# Altium project H3_PCB_PROJ.PrjPCB
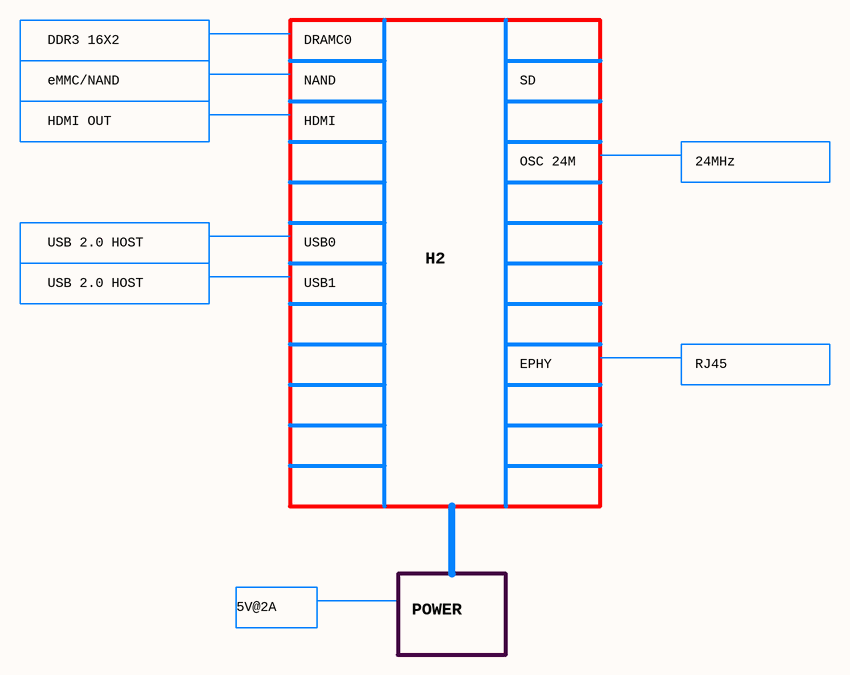
[diagram p0: 1_BLOCK.SchDoc]
6 sheets, 137 parts. Net scope: global (net labels, ports and power ports of the same name join across sheets).
Board files: H3_PCB.PcbDoc, STENCILS.PcbDoc
Sheets:
  1_BLOCK.SchDoc
  2_POWER_TREE.SchDoc
  3_DDR3.SchDoc
  4_CPU.SchDoc
  5_POWER.SchDoc
  6_eMMC.SchDoc

## Sheet 1_BLOCK.SchDoc
size A4

### Notes on the sheet
- DDR3 16X2
- DRAMC0
- eMMC/NAND
- NAND
- SD
- HDMI OUT
- HDMI
- OSC 24M
- 24MHz
- USB 2.0 HOST
- USB0
- USB1
- H2
- EPHY
- RJ45
- 5V@2A
- POWER

## Sheet 2_POWER_TREE.SchDoc
size A4

## Sheet 3_DDR3.SchDoc
size A4
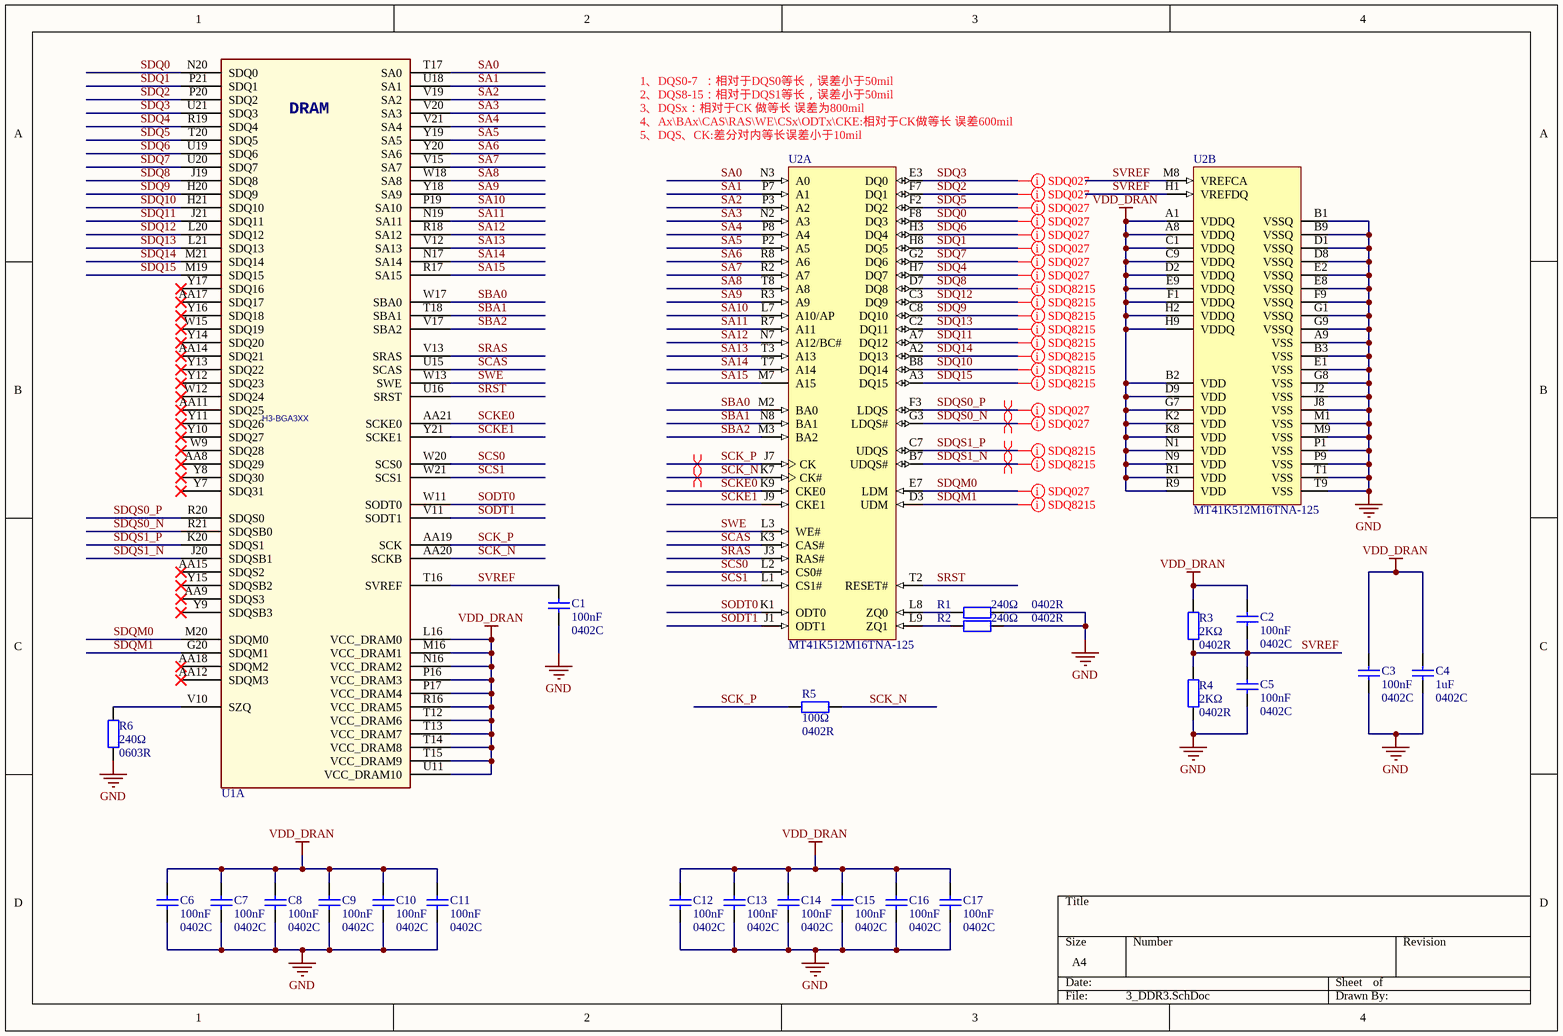
[diagram p1: 3_DDR3.SchDoc]

### Parts
C1  100nF  Package: 0402C  [0402_C]
C2  100nF  Package: 0402C  [0402_C]
C3  100nF  Package: 0402C  [0402_C]
C4  1uF  Package: 0402C  [0402_C]
C5  100nF  Package: 0402C  [0402_C]
C6  100nF  Package: 0402C  [0402_C]
C7  100nF  Package: 0402C  [0402_C]
C8  100nF  Package: 0402C  [0402_C]
C9  100nF  Package: 0402C  [0402_C]
C10  100nF  Package: 0402C  [0402_C]
C11  100nF  Package: 0402C  [0402_C]
C12  100nF  Package: 0402C  [0402_C]
C13  100nF  Package: 0402C  [0402_C]
C14  100nF  Package: 0402C  [0402_C]
C15  100nF  Package: 0402C  [0402_C]
C16  100nF  Package: 0402C  [0402_C]
C17  100nF  Package: 0402C  [0402_C]
R1  240Ω  Package: 0402R  [0402_R]
R2  240Ω  Package: 0402R  [0402_R]
R3  2KΩ  Package: 0402R  [0402_R]
R4  2KΩ  Package: 0402R  [0402_R]
R5  100Ω  Package: 0402R  [0402_R]
R6  240Ω  Package: 0603R  [0603_R]
U1  H3-BGA3XX  [BGA347P0_65B14X14]  (part A of 9)
U2  MT41K512M16TNA-125  [MICT-TNA-96]  (parts A,B of 2)

### Nets
GND: C1.1 C3.1 C4.1 C5.1 C6.1 C7.1 C8.1 C9.1 C10.1 C11.1 C12.1 C13.1 C14.1 C15.1 C16.1 C17.1 R1.1 R2.1 R4.2 R6.1 U2.A9(VSS) U2.B1(VSSQ) U2.B3(VSS) U2.B9(VSSQ) U2.D1(VSSQ) U2.D8(VSSQ) U2.E1(VSS) U2.E2(VSSQ) U2.E8(VSSQ) U2.F9(VSSQ) U2.G1(VSSQ) U2.G8(VSS) U2.G9(VSSQ) U2.J2(VSS) U2.J8(VSS) U2.M1(VSS) U2.M9(VSS) U2.P1(VSS) U2.P9(VSS) U2.T1(VSS) U2.T9(VSS)
VDD_DRAN: C2.2 C3.2 C4.2 C6.2 C7.2 C8.2 C9.2 C10.2 C11.2 C12.2 C13.2 C14.2 C15.2 C16.2 C17.2 R3.1 U1.L16(VCC_DRAM0) U1.M16(VCC_DRAM1) U1.N16(VCC_DRAM2) U1.P16(VCC_DRAM3) U1.P17(VCC_DRAM4) U1.R16(VCC_DRAM5) U1.T12(VCC_DRAM6) U1.T13(VCC_DRAM7) U1.T14(VCC_DRAM8) U1.T15(VCC_DRAM9) U1.U11(VCC_DRAM10) U2.A1(VDDQ) U2.A8(VDDQ) U2.B2(VDD) U2.C1(VDDQ) U2.C9(VDDQ) U2.D2(VDDQ) U2.D9(VDD) U2.E9(VDDQ) U2.F1(VDDQ) U2.G7(VDD) U2.H2(VDDQ) U2.H9(VDDQ) U2.K2(VDD) U2.K8(VDD) U2.N1(VDD) U2.N9(VDD) U2.R1(VDD) U2.R9(VDD)
SA0: U1.T17(SA0) U2.N3(A0)
SA1: U1.U18(SA1) U2.P7(A1)
SA2: U1.V19(SA2) U2.P3(A2)
SA3: U1.V20(SA3) U2.N2(A3)
SA4: U1.V21(SA4) U2.P8(A4)
SA5: U1.Y19(SA5) U2.P2(A5)
SA6: U1.Y20(SA6) U2.R8(A6)
SA7: U1.V15(SA7) U2.R2(A7)
SA8: U1.W18(SA8) U2.T8(A8)
SA9: U1.Y18(SA9) U2.R3(A9)
SA10: U1.P19(SA10) U2.L7(A10/AP)
SA11: U1.N19(SA11) U2.R7(A11)
SA12: U1.R18(SA12) U2.N7(A12/BC#)
SA13: U1.V12(SA13) U2.T3(A13)
SA14: U1.N17(SA14) U2.T7(A14)
SA15: U1.R17(SA15) U2.M7(A15)
SBA0: U1.W17(SBA0) U2.M2(BA0)
SBA1: U1.T18(SBA1) U2.N8(BA1)
SBA2: U1.V17(SBA2) U2.M3(BA2)
SCAS: U1.U15(SCAS) U2.K3(CAS#)
SCK_N: R5.1 U1.AA20(SCKB) U2.K7(CK#)
SCK_P: R5.2 U1.AA19(SCK) U2.J7(CK)
SCKE0: U1.AA21(SCKE0) U2.K9(CKE0)
SCKE1: U1.Y21(SCKE1) U2.J9(CKE1)
SCS0: U1.W20(SCS0) U2.L2(CS0#)
SCS1: U1.W21(SCS1) U2.L1(CS1#)
SDQ0: U1.N20(SDQ0) U2.F8(DQ3)
SDQ1: U1.P21(SDQ1) U2.H8(DQ5)
SDQ2: U1.P20(SDQ2) U2.F7(DQ1)
SDQ3: U1.U21(SDQ3) U2.E3(DQ0)
SDQ4: U1.R19(SDQ4) U2.H7(DQ7)
SDQ5: U1.T20(SDQ5) U2.F2(DQ2)
SDQ6: U1.U19(SDQ6) U2.H3(DQ4)
SDQ7: U1.U20(SDQ7) U2.G2(DQ6)
SDQ8: U1.J19(SDQ8) U2.D7(DQ8)
SDQ9: U1.H20(SDQ9) U2.C8(DQ10)
SDQ10: U1.H21(SDQ10) U2.B8(DQ14)
SDQ11: U1.J21(SDQ11) U2.A7(DQ12)
SDQ12: U1.L20(SDQ12) U2.C3(DQ9)
SDQ13: U1.L21(SDQ13) U2.C2(DQ11)
SDQ14: U1.M21(SDQ14) U2.A2(DQ13)
SDQ15: U1.M19(SDQ15) U2.A3(DQ15)
SDQM0: U1.M20(SDQM0) U2.E7(LDM)
SDQM1: U1.G20(SDQM1) U2.D3(UDM)
SDQS0_N: U1.R21(SDQSB0) U2.G3(LDQS#)
SDQS0_P: U1.R20(SDQS0) U2.F3(LDQS)
SDQS1_N: U1.J20(SDQSB1) U2.B7(UDQS#)
SDQS1_P: U1.K20(SDQS1) U2.C7(UDQS)
SODT0: U1.W11(SODT0) U2.K1(ODT0)
SODT1: U1.V11(SODT1) U2.J1(ODT1)
SRAS: U1.V13(SRAS) U2.J3(RAS#)
SRST: U1.U16(SRST) U2.T2(RESET#)
SVREF: C1.2 C2.1 C5.2 R3.2 R4.1 U1.T16(SVREF) U2.H1(VREFDQ) U2.M8(VREFCA)
SWE: U1.W13(SWE) U2.L3(WE#)
NetR1_2: R1.2 U2.L8(ZQ0)
NetR2_2: R2.2 U2.L9(ZQ1)
NetR6_2: R6.2 U1.V10(SZQ)

Not connected (* = marked no-connect by the designer): U1 AA8(SDQ29)* AA9(SDQS3)* AA11(SDQ25)* AA12(SDQM3)* AA14(SDQ21)* AA15(SDQS2)* AA17(SDQ17)* AA18(SDQM2)* W9(SDQ28)* W12(SDQ24)* W15(SDQ19)* Y7(SDQ31)* Y8(SDQ30)* Y9(SDQSB3)* Y10(SDQ27)* Y11(SDQ26)* Y12(SDQ23)* Y13(SDQ22)* Y14(SDQ20)* Y15(SDQSB2)* Y16(SDQ18)* Y17(SDQ16)*

### Layout directives
differential pair: SCK_N, SCK_P, SDQS0_N, SDQS0_P, SDQS1_N, SDQS1_P
net class Undefined: SDQ0, SDQ1, SDQ2, SDQ3, SDQ4, SDQ5, SDQ6, SDQ7, SDQ8, SDQ9, SDQ10, SDQ11, SDQ12, SDQ13, SDQ14, SDQ15, SDQM0, SDQM1, SDQS0_N, SDQS0_P, SDQS1_N, SDQS1_P

### Notes on the sheet
- (near U2) 1、DQS0-7  ：相对于DQS0等长，误差小于50mil
  2、DQS8-15：相对于DQS1等长，误差小于50mil
  3、DQSx：相对于CK 做等长 误差为800mil
  4、Ax\BAx\CAS\RAS\WE\CSx\ODTx\CKE:相对于CK做等长 误差600mil
  5、DQS、CK:差分对内等长误差小于10mil
- (in symbol H3-BGA3XX, part A) DRAM

### Library data of the parts
C1-C17 = 0402 1nF (102) 10% 50V: 贴片电容; ComponentLink1Description: 供应商链接; ComponentLink1URL: http://www.szlcsc.com/product/details_1875.html; Supplier: LC; SuppliersPartNumber: C1523
R1-R6 = 0402 1KΩ (1001) 1%: 贴片电阻; ComponentLink1Description: 供应商链接; ComponentLink1URL: http://www.szlcsc.com/product/details_12256.html; Supplier: LC; SuppliersPartNumber: C11702
U2 = MT41K512M16TNA-125: 8Gb SDRAM, 512Mb x 16, 1.25ns, 1.35V, 0 to 95 degC, 96-Ball FBGA, Pb-Free; Manufacturer: Micron; CL: CL = 11?; Clock Rate: 800 MHz?; Cycle Time: 1.25ns?; Density: 8Gb?; Op. Temp.: 0C to +95C?; Voltage: 1.35V?; DatasheetVersion: Rev. A; PackageVersion: Rev.E; PackageReference: MICT-TNA-96; PackageDescription: 96-Ball Fine-Pitch Ball Grid Array, 14 x 10 mm, Pitch 0.8 mm; Depth: 512Mb?; Package: FBGA?; Pin Count: 96-ball?; RoHS: Yes?; Width: x16?; Mounting Technology: Surface Mount; PartNumber: MT41K512M16TNA-125; ComponentLink1Description: Manufacturer URL; ComponentLink1URL: http://www.micron.com/; ComponentLink2Description: Datasheet; ComponentLink2URL: http://www.micron.com/~/media/Documents/Products/Data%20Sheet/DRAM/DDR3L_8Gb_x16_2CS_TwinDie_V80A.pdf; ComponentLink3Description: Package Specification; ComponentLink3URL: http://www.micron.com/~/media/Documents/Products/Data%20Sheet/DRAM/DDR3L-RS_8Gb_x16_2CS_TwinDie_V80A.pdf

## Sheet 4_CPU.SchDoc
size A3
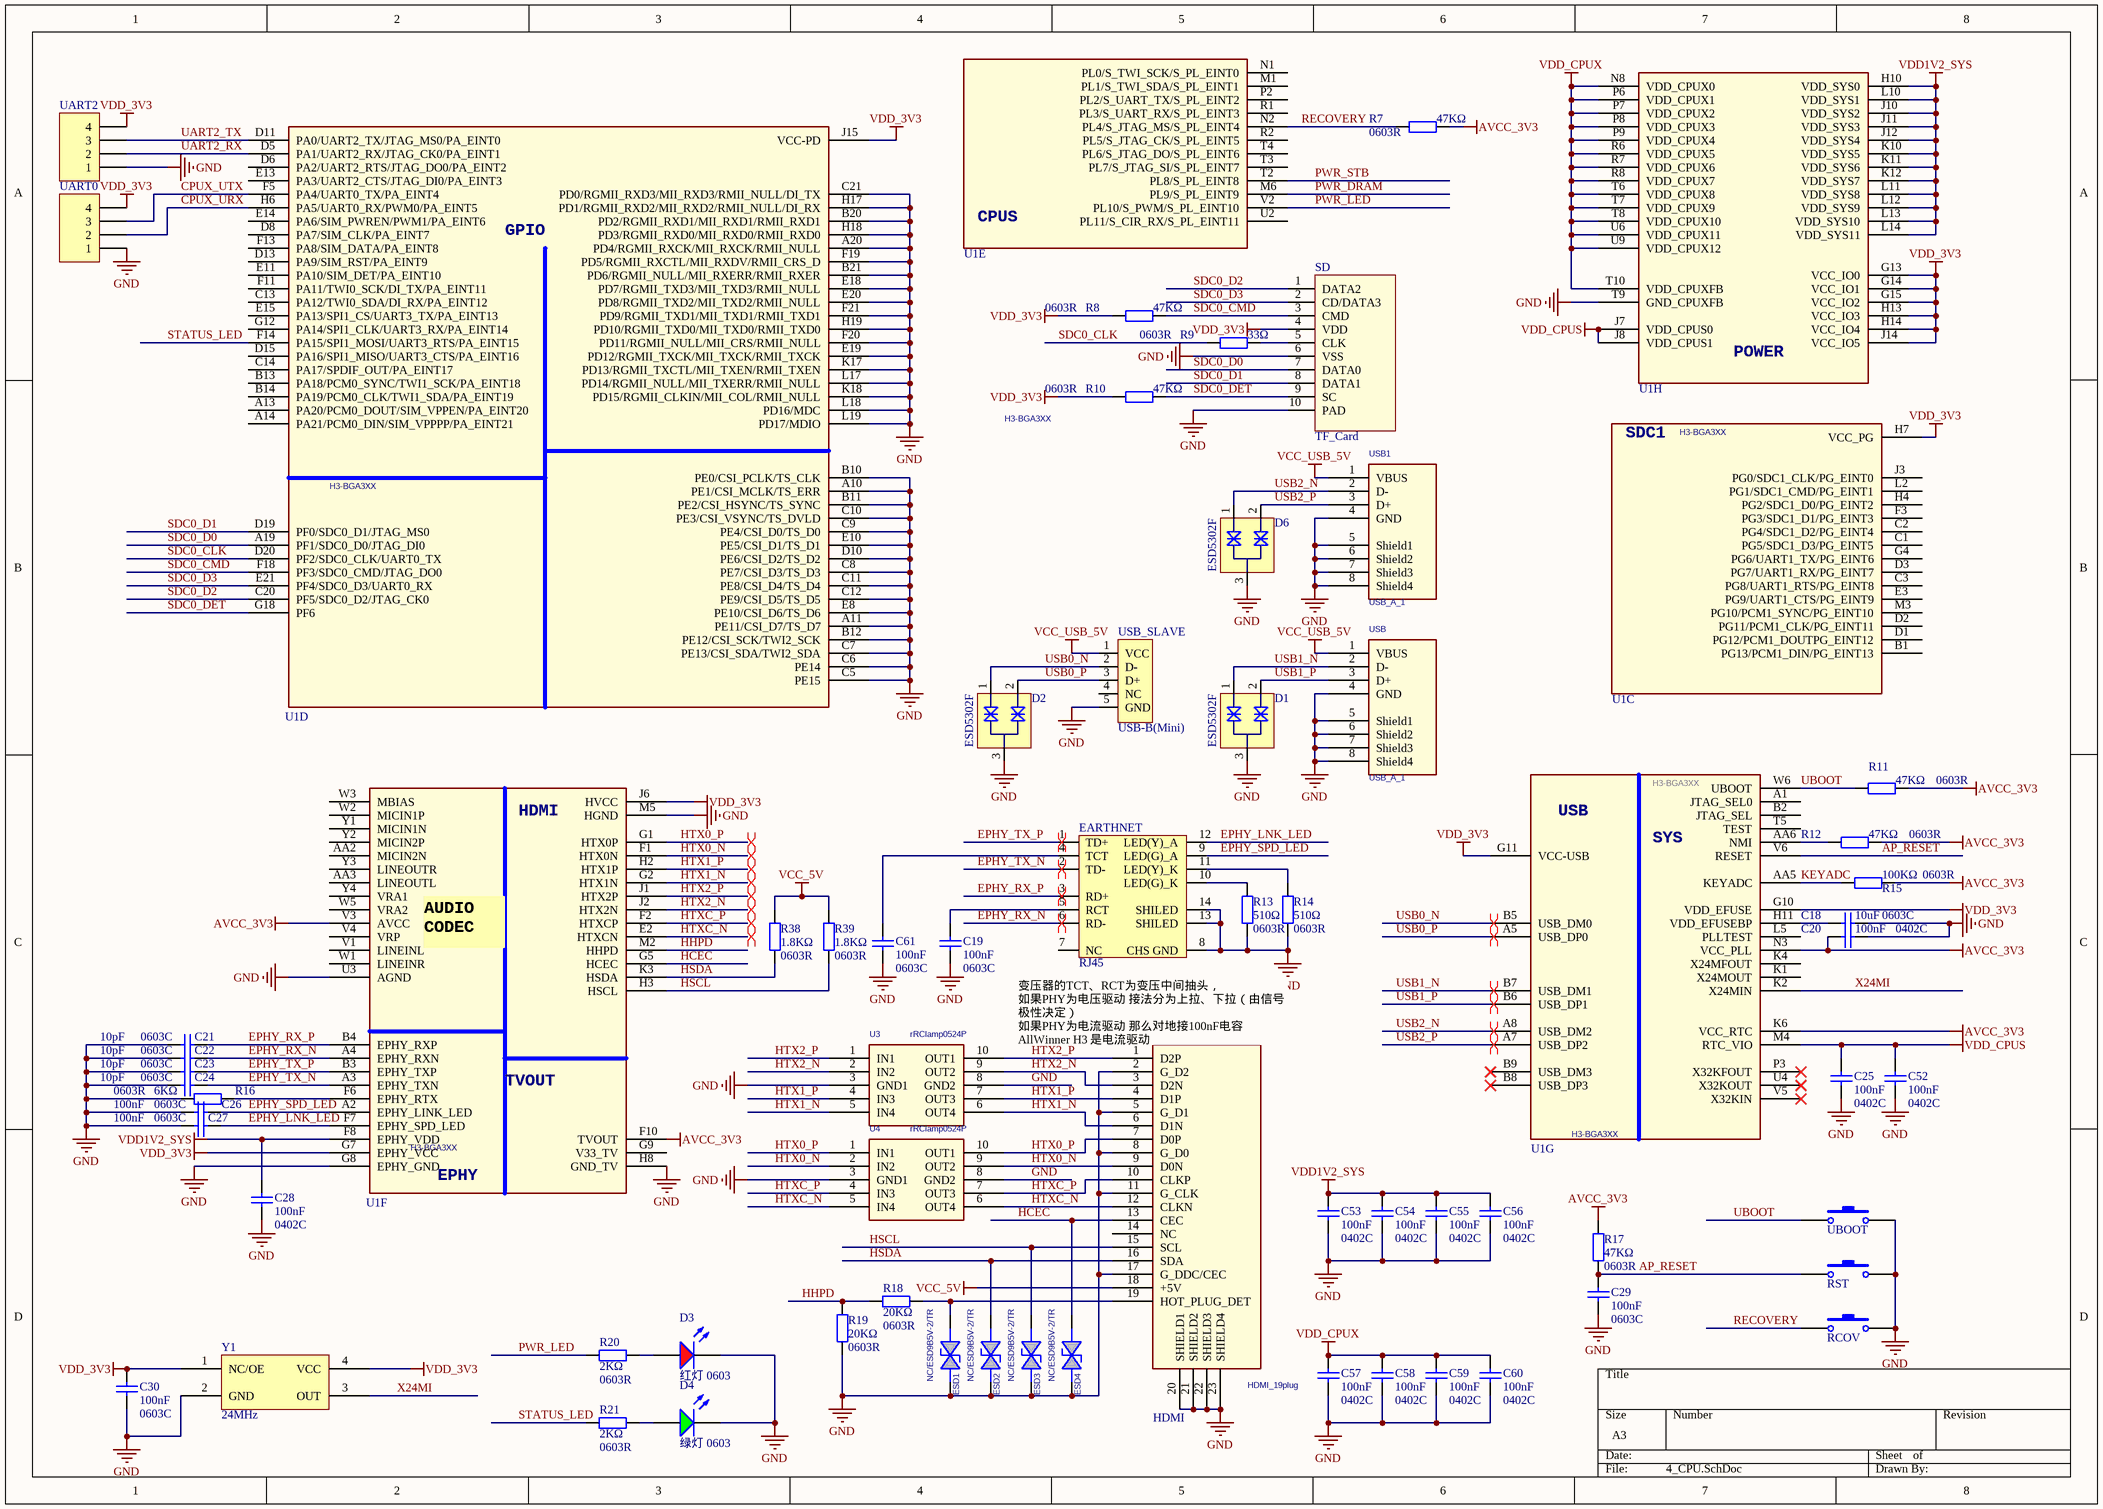
[diagram p2: 4_CPU.SchDoc]

### Parts
C18  10uF  Package: 0603C  [0603_C]
C19  100nF  Package: 0603C  [0603_C]
C20  100nF  Package: 0402C  [0402_C]
C21  10pF  Package: 0603C  [0603_C]
C22  10pF  Package: 0603C  [0603_C]
C23  10pF  Package: 0603C  [0603_C]
C24  10pF  Package: 0603C  [0603_C]
C25  100nF  Package: 0402C  [0402_C]
C26  100nF  Package: 0603C  [0603_C]
C27  100nF  Package: 0603C  [0603_C]
C28  100nF  Package: 0402C  [0402_C]
C29  100nF  Package: 0603C  [0603_C]
C30  100nF  Package: 0603C  [0603_C]
C52  100nF  Package: 0402C  [0402_C]
C53  100nF  Package: 0402C  [0402_C]
C54  100nF  Package: 0402C  [0402_C]
C55  100nF  Package: 0402C  [0402_C]
C56  100nF  Package: 0402C  [0402_C]
C57  100nF  Package: 0402C  [0402_C]
C58  100nF  Package: 0402C  [0402_C]
C59  100nF  Package: 0402C  [0402_C]
C60  100nF  Package: 0402C  [0402_C]
C61  100nF  Package: 0603C  [0603_C]
D1  ESD5302F  [SOT23-3]
D2  ESD5302F  [SOT23-3]
D3  红灯 0603  [0603_LED_S1]
D4  绿灯 0603  [0603_LED_S1]
D6  ESD5302F  [SOT23-3]
EARTHNET  RJ45  [HR911105A]
ESD1  NC/ESD9B5V-2/TR  [tvs0402]
ESD2  NC/ESD9B5V-2/TR  [tvs0402]
ESD3  NC/ESD9B5V-2/TR  [tvs0402]
ESD4  NC/ESD9B5V-2/TR  [tvs0402]
HDMI  HDMI_19plug  [HDMI_SMD_A]
R7  47KΩ  Package: 0603R  [0603_R]
R8  47KΩ  Package: 0603R  [0603_R]
R9  33Ω  Package: 0603R  [0603_R]
R10  47KΩ  Package: 0603R  [0603_R]
R11  47KΩ  Package: 0603R  [0603_R]
R12  47KΩ  Package: 0603R  [0603_R]
R13  510Ω  Package: 0603R  [0603_R]
R14  510Ω  Package: 0603R  [0603_R]
R15  100KΩ  Package: 0603R  [0603_R]
R16  6KΩ  Package: 0603R  [0603_R]
R17  47KΩ  Package: 0603R  [0603_R]
R18  20KΩ  Package: 0603R  [0603_R]
R19  20KΩ  Package: 0603R  [0603_R]
R20  2KΩ  Package: 0603R  [0603_R]
R21  2KΩ  Package: 0603R  [0603_R]
R38  1.8KΩ  Package: 0603R  [0603_R]
R39  1.8KΩ  Package: 0603R  [0603_R]
RCOV  SW-PB  [SW_PB2_A1]  (value not drawn)
RST  SW-PB  [SW_PB2_A1]  (value not drawn)
SD  TF_Card  [SD_MINI]
U1  H3-BGA3XX  [BGA347P0_65B14X14]  (parts C,D,E,F,G,H of 9)
U3  rRClamp0524P  [RCLAMP0524P]
U4  rRClamp0524P  [RCLAMP0524P]
UART0  SWD  [HDR1X4]  (value not drawn)
UART2  SWD  [HDR1X4]  (value not drawn)
UBOOT  SW-PB  [SW_PB2_A1]  (value not drawn)
USB  USB_A_1  [USB_A_1]
USB1  USB_A_1  [USB_A_1]
USB_SLAVE  USB-B(Mini)  [USB/SM0.8-6H5]
Y1  24MHz  [SMDXTAL3225]

### Nets
AVCC_3V3: C20.2 R7.1 R11.1 R12.1 R15.1 R17.1 U1.F10(TVOUT) U1.K6(VCC_RTC) U1.N3(VCC_PLL) U1.V3(AVCC)
GND: C18.2 C19.1 C20.1 C21.2 C22.2 C23.2 C24.2 C25.1 C26.2 C27.2 C28.1 C29.1 C30.1 C52.1 C53.1 C54.1 C55.1 C56.1 C57.1 C58.1 C59.1 C60.1 C61.1 D1.3 D2.3 D3.K D4.K D6.3 EARTHNET.8(CHS_GND) EARTHNET.13(SHILED) EARTHNET.14(SHILED) ESD1.2(CATHODE) ESD2.2(CATHODE) ESD3.2(CATHODE) ESD4.2(CATHODE) HDMI.2(G_D2) HDMI.5(G_D1) HDMI.8(G_D0) HDMI.11(G_CLK) HDMI.17(G_DDC/CEC) HDMI.20(SHIELD1) HDMI.21(SHIELD2) HDMI.22(SHIELD3) HDMI.23(SHIELD4) R13.2 R14.2 R16.2 R19.1 RCOV.2 RST.2 SD.6(VSS) SD.10(PAD) U1.A10(PE1/CSI_MCLK/TS_ERR) U1.A11(PE11/CSI_D7/TS_D7) U1.A20(PD4/RGMII_RXCK/MII_RXCK/RMII_NULL) U1.B10(PE0/CSI_PCLK/TS_CLK) U1.B11(PE2/CSI_HSYNC/TS_SYNC) U1.B12(PE12/CSI_SCK/TWI2_SCK) U1.B20(PD2/RGMII_RXD1/MII_RXD1/RMII_RXD1) U1.B21(PD6/RGMII_NULL/MII_RXERR/RMII_RXER) U1.C5(PE15) U1.C6(PE14) U1.C7(PE13/CSI_SDA/TWI2_SDA) U1.C8(PE7/CSI_D3/TS_D3) U1.C9(PE4/CSI_D0/TS_D0) U1.C10(PE3/CSI_VSYNC/TS_DVLD) U1.C11(PE8/CSI_D4/TS_D4) U1.C12(PE9/CSI_D5/TS_D5) U1.C21(PD0/RGMII_RXD3/MII_RXD3/RMII_NULL/DI_TX) U1.D10(PE6/CSI_D2/TS_D2) U1.E8(PE10/CSI_D6/TS_D6) U1.E10(PE5/CSI_D1/TS_D1) U1.E18(PD7/RGMII_TXD3/MII_TXD3/RMII_NULL) U1.E19(PD12/RGMII_TXCK/MII_TXCK/RMII_TXCK) U1.E20(PD8/RGMII_TXD2/MII_TXD2/RMII_NULL) U1.F19(PD5/RGMII_RXCTL/MII_RXDV/RMII_CRS_D) U1.F20(PD11/RGMII_NULL/MII_CRS/RMII_NULL) U1.F21(PD9/RGMII_TXD1/MII_TXD1/RMII_TXD1) U1.G8(EPHY_GND) U1.H8(GND_TV) U1.H17(PD1/RGMII_RXD2/MII_RXD2/RMII_NULL/DI_RX) U1.H18(PD3/RGMII_RXD0/MII_RXD0/RMII_RXD0) U1.H19(PD10/RGMII_TXD0/MII_TXD0/RMII_TXD0) U1.K17(PD13/RGMII_TXCTL/MII_TXEN/RMII_TXEN) U1.K18(PD15/RGMII_CLKIN/MII_COL/RMII_NULL) U1.L17(PD14/RGMII_NULL/MII_TXERR/RMII_NULL) U1.L18(PD16/MDC) U1.L19(PD17/MDIO) U1.M5(HGND) U1.T9(GND_CPUXFB) U1.U3(AGND) U3.3(GND1) U3.8(GND2) U4.3(GND1) U4.8(GND2) UART0.1 UART2.1 UBOOT.2 USB.4(GND) USB.5(Shield1) USB.6(Shield2) USB.7(Shield3) USB.8(Shield4) USB1.4(GND) USB1.5(Shield1) USB1.6(Shield2) USB1.7(Shield3) USB1.8(Shield4) USB_SLAVE.5(GND) Y1.2(GND)
VCC_5V: HDMI.18(+5V) R38.1 R39.1 USB.1(VBUS) USB1.1(VBUS) USB_SLAVE.1(VCC)  [also labelled VCC_USB_5V]
VDD1V2_SYS: C28.2 C53.2 C54.2 C55.2 C56.2 U1.F8(EPHY_VDD) U1.H10(VDD_SYS0) U1.J10(VDD_SYS2) U1.J11(VDD_SYS3) U1.J12(VDD_SYS4) U1.K10(VDD_SYS5) U1.K11(VDD_SYS6) U1.K12(VDD_SYS7) U1.L10(VDD_SYS1) U1.L11(VDD_SYS8) U1.L12(VDD_SYS9) U1.L13(VDD_SYS10) U1.L14(VDD_SYS11)
VDD_3V3: C30.2 R8.2 R10.2 SD.4(VDD) U1.G7(EPHY_VCC) U1.G10(VDD_EFUSE) U1.G11(VCC-USB) U1.G13(VCC_IO0) U1.G14(VCC_IO1) U1.G15(VCC_IO2) U1.H7(VCC_PG) U1.H13(VCC_IO3) U1.H14(VCC_IO4) U1.J6(HVCC) U1.J14(VCC_IO5) U1.J15(VCC-PD) UART0.4 UART2.4 Y1.1(NC/OE) Y1.4(VCC)
VDD_CPUS: C25.2 C52.2 U1.J7(VDD_CPUS0) U1.J8(VDD_CPUS1) U1.M4(RTC_VIO)
VDD_CPUX: C57.2 C58.2 C59.2 C60.2 U1.N8(VDD_CPUX0) U1.P6(VDD_CPUX1) U1.P7(VDD_CPUX2) U1.P8(VDD_CPUX3) U1.P9(VDD_CPUX4) U1.R6(VDD_CPUX5) U1.R7(VDD_CPUX6) U1.R8(VDD_CPUX7) U1.T6(VDD_CPUX8) U1.T7(VDD_CPUX9) U1.T8(VDD_CPUX10) U1.T10(VDD_CPUXFB) U1.U6(VDD_CPUX11) U1.U9(VDD_CPUX12)
AP_RESET: C29.2 R17.2 RST.1 U1.V6(RESET)
CPUX_URX: U1.H6(PA5/UART0_RX/PWM0/PA_EINT5) UART0.2
CPUX_UTX: U1.F5(PA4/UART0_TX/PA_EINT4) UART0.3
EPHY_LNK_LED: C27.1 EARTHNET.12(LED(Y)_A) U1.F7(EPHY_SPD_LED)
EPHY_RX_N: C22.1 EARTHNET.6(RD-) U1.A4(EPHY_RXN)
EPHY_RX_P: C21.1 EARTHNET.3(RD+) U1.B4(EPHY_RXP)
EPHY_SPD_LED: C26.1 EARTHNET.9(LED(G)_A) U1.A2(EPHY_LINK_LED)
EPHY_TX_N: C24.1 EARTHNET.2(TD-) U1.A3(EPHY_TXN)
EPHY_TX_P: C23.1 EARTHNET.1(TD+) U1.B3(EPHY_TXP)
HCEC: ESD4.1(ANODE) HDMI.13(CEC) U1.G5(HCEC)
HHPD: R18.1 R19.2 U1.M2(HHPD)
HSCL: ESD3.1(ANODE) HDMI.15(SCL) R39.2 U1.H3(HSCL)
HSDA: ESD2.1(ANODE) HDMI.16(SDA) R38.2 U1.K3(HSDA)
HTX0_N: HDMI.9(D0N) U1.F1(HTX0N) U4.2(IN2) U4.9(OUT2)
HTX0_P: HDMI.7(D0P) U1.G1(HTX0P) U4.1(IN1) U4.10(OUT1)
HTX1_N: HDMI.6(D1N) U1.G2(HTX1N) U3.5(IN4) U3.6(OUT4)
HTX1_P: HDMI.4(D1P) U1.H2(HTX1P) U3.4(IN3) U3.7(OUT3)
HTX2_N: HDMI.3(D2N) U1.J2(HTX2N) U3.2(IN2) U3.9(OUT2)
HTX2_P: HDMI.1(D2P) U1.J1(HTX2P) U3.1(IN1) U3.10(OUT1)
HTXC_N: HDMI.12(CLKN) U1.E2(HTXCN) U4.5(IN4) U4.6(OUT4)
HTXC_P: HDMI.10(CLKP) U1.F2(HTXCP) U4.4(IN3) U4.7(OUT3)
KEYADC: R15.2 U1.AA5(KEYADC)
PWR_DRAM: U1.M6(PL9/S_PL_EINT9)
PWR_LED: R20.1 U1.V2(PL10/S_PWM/S_PL_EINT10)
PWR_STB: U1.T2(PL8/S_PL_EINT8)
RECOVERY: R7.2 RCOV.1 U1.N2(PL4/S_JTAG_MS/S_PL_EINT4)
SDC0_CLK: R9.2 U1.D20(PF2/SDC0_CLK/UART0_TX)
SDC0_CMD: R8.1 SD.3(CMD) U1.F18(PF3/SDC0_CMD/JTAG_DO0)
SDC0_D0: SD.7(DATA0) U1.A19(PF1/SDC0_D0/JTAG_DI0)
SDC0_D1: SD.8(DATA1) U1.D19(PF0/SDC0_D1/JTAG_MS0)
SDC0_D2: SD.1(DATA2) U1.C20(PF5/SDC0_D2/JTAG_CK0)
SDC0_D3: SD.2(CD/DATA3) U1.E21(PF4/SDC0_D3/UART0_RX)
SDC0_DET: R10.1 SD.9(SC) U1.G18(PF6)
STATUS_LED: R21.1 U1.F14(PA15/SPI1_MOSI/UART3_RTS/PA_EINT15)
UART2_RX: U1.D5(PA1/UART2_RX/JTAG_CK0/PA_EINT1) UART2.2
UART2_TX: U1.D11(PA0/UART2_TX/JTAG_MS0/PA_EINT0) UART2.3
UBOOT: R11.2 U1.W6(UBOOT) UBOOT.1
USB0_N: D2.1 U1.B5(USB_DM0) USB_SLAVE.2(D-)
USB0_P: D2.2 U1.A5(USB_DP0) USB_SLAVE.3(D+)
USB1_N: D1.1 U1.B7(USB_DM1) USB.2(D-)
USB1_P: D1.2 U1.B6(USB_DP1) USB.3(D+)
USB2_N: D6.1 U1.A8(USB_DM2) USB1.2(D-)
USB2_P: D6.2 U1.A7(USB_DP2) USB1.3(D+)
X24MI: U1.K2(X24MIN) Y1.3(OUT)
NetC18_1: C18.1 U1.H11(VDD_EFUSEBP)
NetC19_2: C19.2 EARTHNET.5(RCT)
NetC61_2: C61.2 EARTHNET.4(TCT)
NetD3_A: D3.A R20.2
NetD4_A: D4.A R21.2
NetEARTHNET_10: EARTHNET.10(LED(G)_K) R13.1
NetEARTHNET_11: EARTHNET.11(LED(Y)_K) R14.1
NetESD1_1: ESD1.1(ANODE) HDMI.19(HOT_PLUG_DET) R18.2
NetR9_1: R9.1 SD.5(CLK)
NetR12_2: R12.2 U1.AA6(NMI)
NetR16_1: R16.1 U1.F6(EPHY_RTX)

Not connected (* = marked no-connect by the designer): EARTHNET 7(NC); HDMI 14(NC); U1 A1(JTAG_SEL0) A13(PA20/PCM0_DOUT/SIM_VPPEN/PA_EINT20) A14(PA21/PCM0_DIN/SIM_VPPPP/PA_EINT21) AA2(MICIN2N) AA3(LINEOUTL) B1(PG13/PCM1_DIN/PG_EINT13) B2(JTAG_SEL) B8(USB_DP3)* B9(USB_DM3)* B13(PA18/PCM0_SYNC/TWI1_SCK/PA_EINT18) B14(PA19/PCM0_CLK/TWI1_SDA/PA_EINT19) C1(PG5/SDC1_D3/PG_EINT5) C2(PG4/SDC1_D2/PG_EINT4) C3(PG8/UART1_RTS/PG_EINT8) C13(PA12/TWI0_SDA/DI_RX/PA_EINT12) C14(PA17/SPDIF_OUT/PA_EINT17) D1(PG12/PCM1_DOUTPG_EINT12) D2(PG11/PCM1_CLK/PG_EINT11) D3(PG7/UART1_RX/PG_EINT7) D6(PA2/UART2_RTS/JTAG_DO0/PA_EINT2) D8(PA7/SIM_CLK/PA_EINT7) D13(PA9/SIM_RST/PA_EINT9) D15(PA16/SPI1_MISO/UART3_CTS/PA_EINT16) E3(PG9/UART1_CTS/PG_EINT9) E11(PA10/SIM_DET/PA_EINT10) E13(PA3/UART2_CTS/JTAG_DI0/PA_EINT3) E14(PA6/SIM_PWREN/PWM1/PA_EINT6) E15(PA13/SPI1_CS/UART3_TX/PA_EINT13) F3(PG3/SDC1_D1/PG_EINT3) F11(PA11/TWI0_SCK/DI_TX/PA_EINT11) F13(PA8/SIM_DATA/PA_EINT8) G4(PG6/UART1_TX/PG_EINT6) G9(V33_TV) G12(PA14/SPI1_CLK/UART3_RX/PA_EINT14) H4(PG2/SDC1_D0/PG_EINT2) J3(PG0/SDC1_CLK/PG_EINT0) K1(X24MOUT) K4(X24MFOUT) L2(PG1/SDC1_CMD/PG_EINT1) L5(PLLTEST) M1(PL1/S_TWI_SDA/S_PL_EINT1) M3(PG10/PCM1_SYNC/PG_EINT10) N1(PL0/S_TWI_SCK/S_PL_EINT0) P2(PL2/S_UART_TX/S_PL_EINT2) P3(X32KFOUT)* R1(PL3/S_UART_RX/S_PL_EINT3) R2(PL5/S_JTAG_CK/S_PL_EINT5) T3(PL7/S_JTAG_SI/S_PL_EINT7) T4(PL6/S_JTAG_DO/S_PL_EINT6) T5(TEST) U2(PL11/S_CIR_RX/S_PL_EINT11) U4(X32KOUT)* V1(LINEINL) V4(VRP) V5(X32KIN)* W1(LINEINR) W2(MICIN1P) W3(MBIAS) W5(VRA2) Y1(MICIN1N) Y2(MICIN2P) Y3(LINEOUTR) Y4(VRA1); USB_SLAVE 4(NC)

### Layout directives
differential pair: EPHY_RX_N, EPHY_RX_P, EPHY_TX_N, EPHY_TX_P, HTX0_N, HTX0_P, HTX1_N, HTX1_P, HTX2_N, HTX2_P, HTXC_N, HTXC_P, USB0_N, USB0_P, USB1_N, USB1_P, USB2_N, USB2_P

### Notes on the sheet
- (near HDMI) 变压器的TCT、RCT为变压中间抽头，
  如果PHY为电压驱动 接法分为上拉、下拉（由信号极性决定）
  如果PHY为电流驱动 那么对地接100nF电容
  AllWinner H3 是电流驱动
- (in symbol H3-BGA3XX, part C) SDC1
- (in symbol H3-BGA3XX, part D) GPIO
- (in symbol H3-BGA3XX, part E) CPUS
- (in symbol H3-BGA3XX, part F) HDMI; AUDIO / CODEC; EPHY
- (in symbol H3-BGA3XX, part G) USB; SYS
- (in symbol H3-BGA3XX, part H) POWER

### Library data of the parts
C18 = 0603 2.7pF (2R7) 0.25pF 50V: 贴片电容; ComponentLink1Description: 供应商链接; ComponentLink1URL: http://www.szlcsc.com/product/details_16831.html; Supplier: LC; SuppliersPartNumber: C16149
C19-C30 C52-C61 = 0402 1nF (102) 10% 50V: 贴片电容; ComponentLink1Description: 供应商链接; ComponentLink1URL: http://www.szlcsc.com/product/details_1875.html; Supplier: LC; SuppliersPartNumber: C1523
D3 = 0603 红灯: 发光二极管; ComponentLink1Description: 供应商链接; ComponentLink1URL: http://www.szlcsc.com/product/details_2659.html; Package: 0603; Supplier: LC; SuppliersPartNumber: C2286
D4 = 0603 绿灯: 发光二极管; ComponentLink1Description: 供应商链接; ComponentLink1URL: http://www.szlcsc.com/product/details_73152.html; Package: 0603; Supplier: LC; SuppliersPartNumber: C72043
EARTHNET = HR911105
ESD1-ESD4 = 1_1.5KE100A: 1ST PART DESCRIPTION: WILL ESD9B5V Bidirection ESD Protection
HDMI = HDMI19_PLUG
R7-R21 R38 R39 = 0402 1KΩ (1001) 1%: 贴片电阻; ComponentLink1Description: 供应商链接; ComponentLink1URL: http://www.szlcsc.com/product/details_12256.html; Supplier: LC; SuppliersPartNumber: C11702
RCOV RST UBOOT = SW-PB: 微动开关; Published: 24-Mar-1999; LatestRevisionDate: 17-Jul-2002; LatestRevisionNote: Re-released for DXP Platform.; PackageReference: SPST-2; Publisher: Altium Limited
SD = TF_Card: TF卡座; 版权归属: 源创客; BOM名称: TF卡座; 学习资源: www.ooocke.com
UART0 UART2 = Header 4: Header, 4-Pin; LatestRevisionDate: 17-Jul-2002; LatestRevisionNote: Re-released for DXP Platform.; Publisher: Altium Limited
USB_SLAVE = USB5
Y1 = XTAL4_OSCILLATOR: 有源晶振; value: 7.3728M

## Sheet 5_POWER.SchDoc
size A4
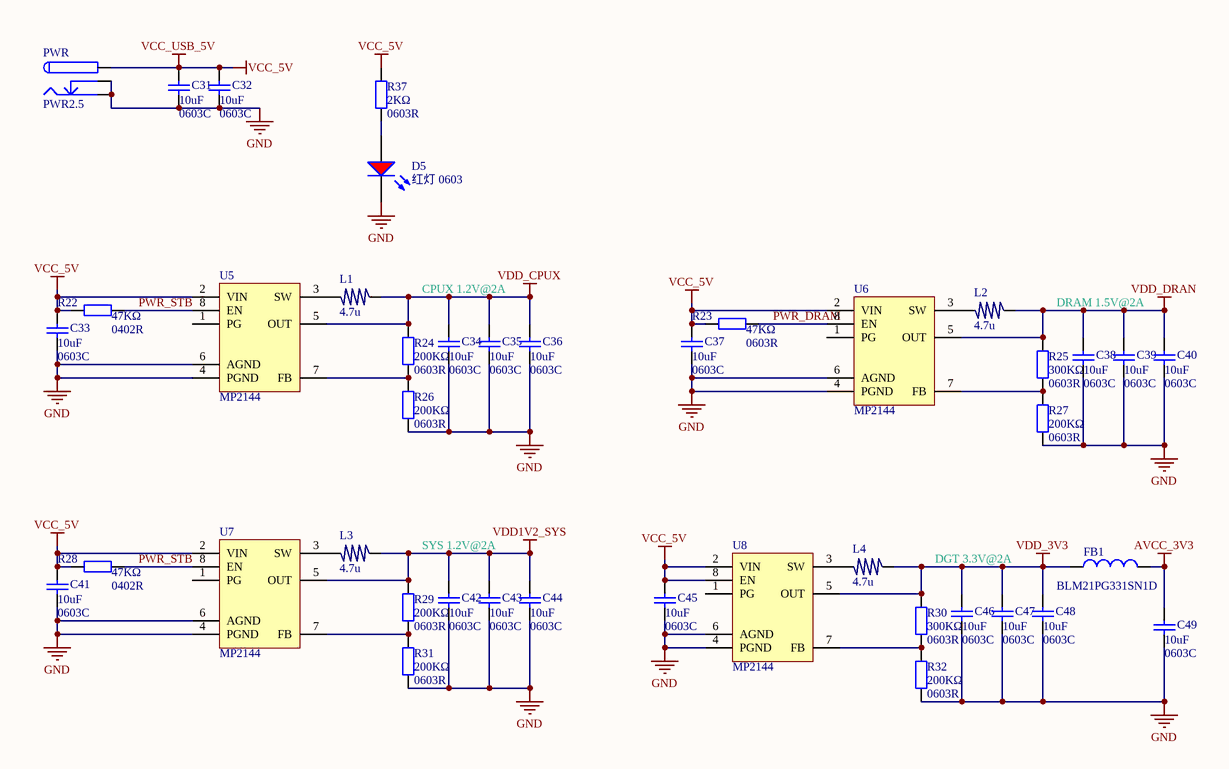
[diagram p3: 5_POWER.SchDoc]

### Parts
C31  10uF  Package: 0603C  [0603_C]
C32  10uF  Package: 0603C  [0603_C]
C33  10uF  Package: 0603C  [0603_C]
C34  10uF  Package: 0603C  [0603_C]
C35  10uF  Package: 0603C  [0603_C]
C36  10uF  Package: 0603C  [0603_C]
C37  10uF  Package: 0603C  [0603_C]
C38  10uF  Package: 0603C  [0603_C]
C39  10uF  Package: 0603C  [0603_C]
C40  10uF  Package: 0603C  [0603_C]
C41  10uF  Package: 0603C  [0603_C]
C42  10uF  Package: 0603C  [0603_C]
C43  10uF  Package: 0603C  [0603_C]
C44  10uF  Package: 0603C  [0603_C]
C45  10uF  Package: 0603C  [0603_C]
C46  10uF  Package: 0603C  [0603_C]
C47  10uF  Package: 0603C  [0603_C]
C48  10uF  Package: 0603C  [0603_C]
C49  10uF  Package: 0603C  [0603_C]
D5  红灯 0603  [0603_LED_S1]
FB1  BLM21PG331SN1D  [F0805]
L1  value 4.7u  [CD43NP]  (hidden comment: 4R7_CD43)
L2  value 4.7u  [CD43NP]  (hidden comment: 4R7_CD43)
L3  value 4.7u  [CD43NP]  (hidden comment: 4R7_CD43)
L4  value 4.7u  [CD43NP]  (hidden comment: 4R7_CD43)
PWR  PWR2.5  [DC-PJ044A]
R22  47KΩ  Package: 0402R  [0402_R]
R23  47KΩ  Package: 0603R  [0603_R]
R24  200KΩ  Package: 0603R  [0603_R]
R25  300KΩ  Package: 0603R  [0603_R]
R26  200KΩ  Package: 0603R  [0603_R]
R27  200KΩ  Package: 0603R  [0603_R]
R28  47KΩ  Package: 0402R  [0402_R]
R29  200KΩ  Package: 0603R  [0603_R]
R30  300KΩ  Package: 0603R  [0603_R]
R31  200KΩ  Package: 0603R  [0603_R]
R32  200KΩ  Package: 0603R  [0603_R]
R37  2KΩ  Package: 0603R  [0603_R]
U5  MP2144  [SOT23-8]
U6  MP2144  [SOT23-8]
U7  MP2144  [SOT23-8]
U8  MP2144  [SOT23-8]

### Nets
AVCC_3V3: C49.2 FB1.2
GND: C31.1 C32.1 C33.1 C34.1 C35.1 C36.1 C37.1 C38.1 C39.1 C40.1 C41.1 C42.1 C43.1 C44.1 C45.1 C46.1 C47.1 C48.1 C49.1 D5.K PWR.2 PWR.3 R26.2 R27.2 R31.2 R32.2 U5.4(PGND) U5.6(AGND) U6.4(PGND) U6.6(AGND) U7.4(PGND) U7.6(AGND) U8.4(PGND) U8.6(AGND)
VCC_5V: C31.2 C32.2 C33.2 C37.2 C41.2 C45.2 PWR.1 R22.1 R23.1 R28.1 R37.1 U5.2(VIN) U6.2(VIN) U7.2(VIN) U8.2(VIN) U8.8(EN)  [also labelled VCC_USB_5V]
VDD1V2_SYS: C42.2 C43.2 C44.2 L3.1 R29.1 U7.5(OUT)
VDD_3V3: C46.2 C47.2 C48.2 FB1.1 L4.1 R30.1 U8.5(OUT)
VDD_CPUX: C34.2 C35.2 C36.2 L1.1 R24.1 U5.5(OUT)
VDD_DRAN: C38.2 C39.2 C40.2 L2.1 R25.1 U6.5(OUT)
PWR_DRAM: R23.2 U6.8(EN)
PWR_STB: R22.2 R28.2 U5.8(EN) U7.8(EN)
NetD5_A: D5.A R37.2
NetL1_2: L1.2 U5.3(SW)
NetL2_2: L2.2 U6.3(SW)
NetL3_2: L3.2 U7.3(SW)
NetL4_2: L4.2 U8.3(SW)
NetR24_2: R24.2 R26.1 U5.7(FB)
NetR25_2: R25.2 R27.1 U6.7(FB)
NetR29_2: R29.2 R31.1 U7.7(FB)
NetR30_2: R30.2 R32.1 U8.7(FB)

Not connected (* = marked no-connect by the designer): U5 1(PG); U6 1(PG); U7 1(PG); U8 1(PG)

### Notes on the sheet
- CPUX 1.2V@2A
- DRAM 1.5V@2A
- SYS 1.2V@2A
- DGT 3.3V@2A

### Library data of the parts
C31-C49 = 0603 1uF (105) 10% 50V: 贴片电容; ComponentLink1Description: 供应商链接; ComponentLink1URL: http://www.szlcsc.com/product/details_16531.html; Supplier: LC; SuppliersPartNumber: C15849
D5 = 0603 红灯: 发光二极管; ComponentLink1Description: 供应商链接; ComponentLink1URL: http://www.szlcsc.com/product/details_2659.html; Package: 0603; Supplier: LC; SuppliersPartNumber: C2286
FB1 = FB: 磁珠
L1-L4 = L
PWR = PWR2.5: Low Voltage Power Supply Connector; Published: 17-Dec-2003; DatasheetDocument: 09-May-2002; Publisher: Altium Limited; ComponentLink1Description: Manufacturer Link; ComponentLink1URL: http://domino.kycon.com/internet/Products.html
R22-R32 R37 = 0402 1KΩ (1001) 1%: 贴片电阻; ComponentLink1Description: 供应商链接; ComponentLink1URL: http://www.szlcsc.com/product/details_12256.html; Supplier: LC; SuppliersPartNumber: C11702

## Sheet 6_eMMC.SchDoc
size A4
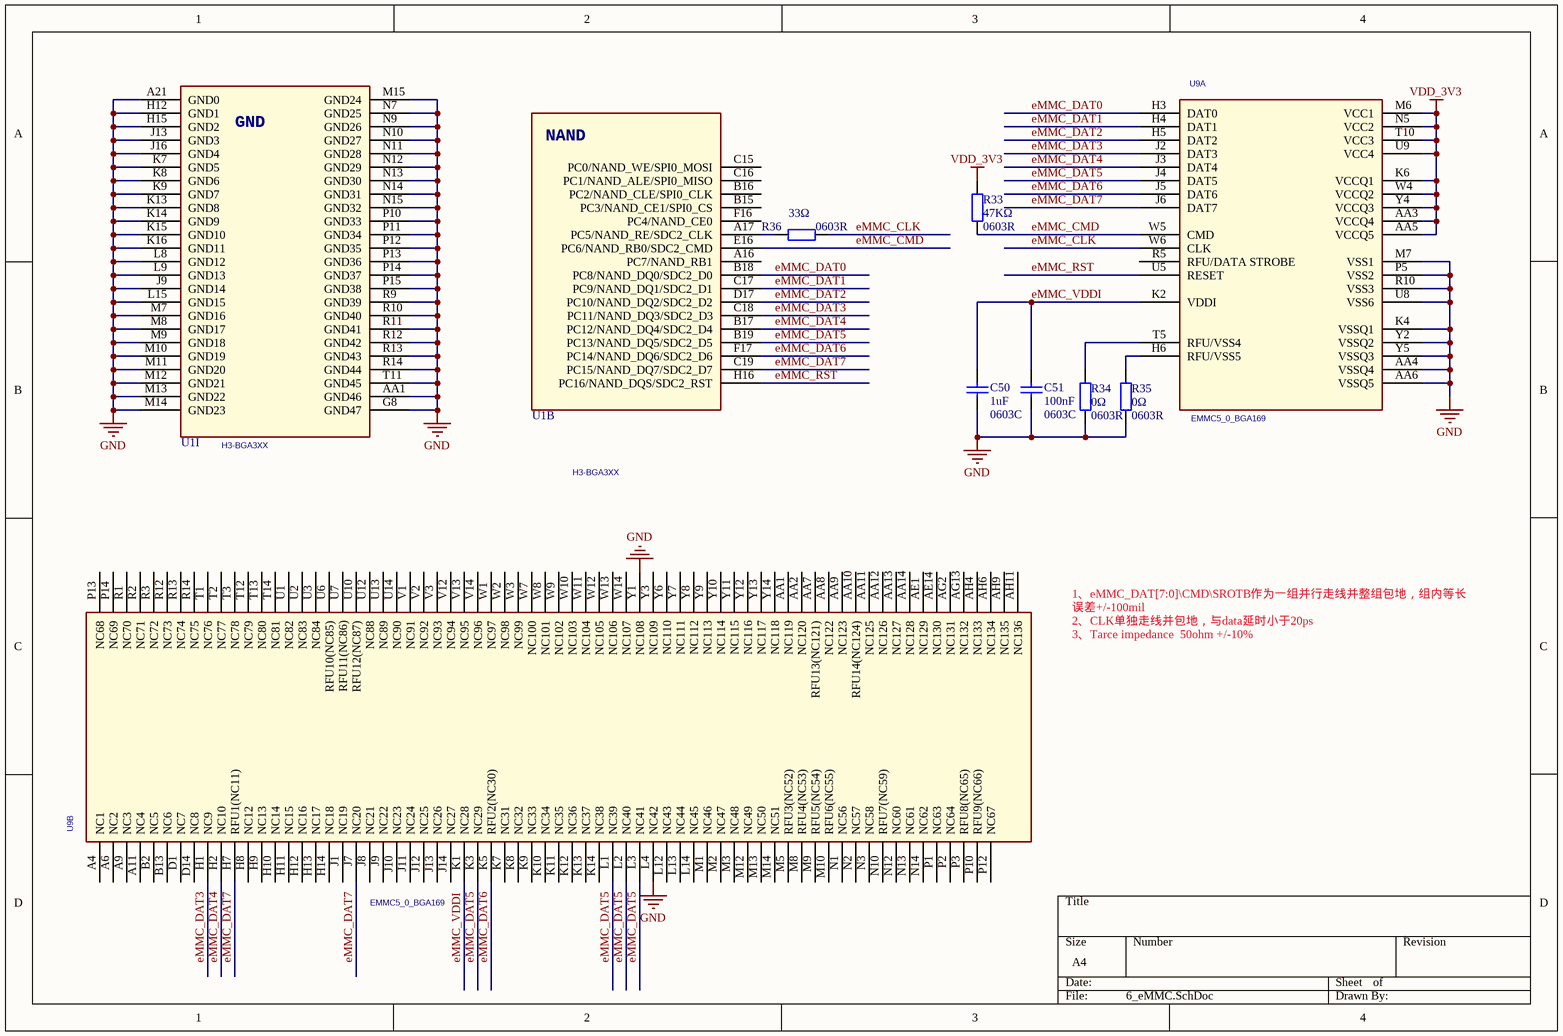
[diagram p4: 6_eMMC.SchDoc]

### Parts
C50  1uF  Package: 0603C  [0603_C]
C51  100nF  Package: 0603C  [0603_C]
R33  47KΩ  Package: 0603R  [0603_R]
R34  0Ω  Package: 0603R  [0603_R]
R35  0Ω  Package: 0603R  [0603_R]
R36  33Ω  Package: 0603R  [0603_R]
U1  H3-BGA3XX  [BGA347P0_65B14X14]  (parts B,I of 9)
U9  EMMC5_0_BGA169  [BGA169P0_50B12_00X16_00H1_00]  (parts A,B of 2)

### Nets
GND: C50.2 C51.2 R34.2 R35.2 U1.A21(GND0) U1.AA1(GND46) U1.G8(GND47) U1.H12(GND1) U1.H15(GND2) U1.J9(GND14) U1.J13(GND3) U1.J16(GND4) U1.K7(GND5) U1.K8(GND6) U1.K9(GND7) U1.K13(GND8) U1.K14(GND9) U1.K15(GND10) U1.K16(GND11) U1.L8(GND12) U1.L9(GND13) U1.L15(GND15) U1.M7(GND16) U1.M8(GND17) U1.M9(GND18) U1.M10(GND19) U1.M11(GND20) U1.M12(GND21) U1.M13(GND22) U1.M14(GND23) U1.M15(GND24) U1.N7(GND25) U1.N9(GND26) U1.N10(GND27) U1.N11(GND28) U1.N12(GND29) U1.N13(GND30) U1.N14(GND31) U1.N15(GND32) U1.P10(GND33) U1.P11(GND34) U1.P12(GND35) U1.P13(GND36) U1.P14(GND37) U1.P15(GND38) U1.R9(GND39) U1.R10(GND40) U1.R11(GND41) U1.R12(GND42) U1.R13(GND43) U1.R14(GND44) U1.T11(GND45) U9.AA4(VSSQ4) U9.AA6(VSSQ5) U9.K4(VSSQ1) U9.L4(NC42) U9.M7(VSS1) U9.P5(VSS2) U9.R10(VSS3) U9.U8(VSS6) U9.Y1(NC108) U9.Y2(VSSQ2) U9.Y5(VSSQ3)
VDD_3V3: R33.1 U9.AA3(VCCQ4) U9.AA5(VCCQ5) U9.K6(VCCQ1) U9.M6(VCC1) U9.N5(VCC2) U9.T10(VCC3) U9.U9(VCC4) U9.W4(VCCQ2) U9.Y4(VCCQ3)
eMMC_CLK: R36.2 U9.W6(CLK)
eMMC_CMD: R33.2 U1.E16(PC6/NAND_RB0/SDC2_CMD) U9.W5(CMD)
eMMC_DAT0: U1.B18(PC8/NAND_DQ0/SDC2_D0) U9.H3(DAT0)
eMMC_DAT1: U1.C17(PC9/NAND_DQ1/SDC2_D1) U9.H4(DAT1)
eMMC_DAT2: U1.D17(PC10/NAND_DQ2/SDC2_D2) U9.H5(DAT2)
eMMC_DAT3: U1.C18(PC11/NAND_DQ3/SDC2_D3) U9.H1(NC9) U9.J2(DAT3)
eMMC_DAT4: U1.B17(PC12/NAND_DQ4/SDC2_D4) U9.H2(NC10) U9.J3(DAT4)
eMMC_DAT5: U1.B19(PC13/NAND_DQ5/SDC2_D5) U9.J4(DAT5) U9.K3(NC29) U9.L1(NC39) U9.L2(NC40) U9.L3(NC41)
eMMC_DAT6: U1.F17(PC14/NAND_DQ6/SDC2_D6) U9.J5(DAT6) U9.K5(RFU2(NC30))
eMMC_DAT7: U1.C19(PC15/NAND_DQ7/SDC2_D7) U9.H7(RFU1(NC11)) U9.J6(DAT7) U9.J7(NC20)
eMMC_RST: U1.H16(PC16/NAND_DQS/SDC2_RST) U9.U5(RESET)
eMMC_VDDI: C50.1 C51.1 U9.K1(NC28) U9.K2(VDDI)
NetR34_1: R34.1 U9.T5(RFU/VSS4)
NetR35_1: R35.1 U9.H6(RFU/VSS5)
NetR36_1: R36.1 U1.A17(PC5/NAND_RE/SDC2_CLK)

Not connected (* = marked no-connect by the designer): U1 A16(PC7/NAND_RB1) B15(PC3/NAND_CE1/SPI0_CS) B16(PC2/NAND_CLE/SPI0_CLK) C15(PC0/NAND_WE/SPI0_MOSI) C16(PC1/NAND_ALE/SPI0_MISO) F16(PC4/NAND_CE0); U9 A4(NC1) A6(NC2) A9(NC3) A11(NC4) AA1(NC119) AA2(NC120) AA7(RFU13(NC121)) AA8(NC122) AA9(NC123) AA10(RFU14(NC124)) AA11(NC125) AA12(NC126) AA13(NC127) AA14(NC128) AE1(NC129) AE14(NC130) AG2(NC131) AG13(NC132) AH4(NC133) AH6(NC134) AH9(NC135) AH11(NC136) B2(NC5) B13(NC6) D1(NC7) D14(NC8) H8(NC12) H9(NC13) H10(NC14) H11(NC15) H12(NC16) H13(NC17) H14(NC18) J1(NC19) J8(NC21) J9(NC22) J10(NC23) J11(NC24) J12(NC25) J13(NC26) J14(NC27) K7(NC31) K8(NC32) K9(NC33) K10(NC34) K11(NC35) K12(NC36) K13(NC37) K14(NC38) L12(NC43) L13(NC44) L14(NC45) M1(NC46) M2(NC47) M3(NC48) M5(RFU3(NC52)) M8(RFU4(NC53)) M9(RFU5(NC54)) M10(RFU6(NC55)) M12(NC49) M13(NC50) M14(NC51) N1(NC56) N2(NC57) N3(NC58) N10(RFU7(NC59)) N12(NC60) N13(NC61) N14(NC62) P1(NC63) P2(NC64) P3(RFU8(NC65)) P10(RFU9(NC66)) P12(NC67) P13(NC68) P14(NC69) R1(NC70) R2(NC71) R3(NC72) R5(RFU/DATA_STROBE) R12(NC73) R13(NC74) R14(NC75) T1(NC76) T2(NC77) T3(NC78) T12(NC79) T13(NC80) T14(NC81) U1(NC82) U2(NC83) U3(NC84) U6(RFU10(NC85)) U7(RFU11(NC86)) U10(RFU12(NC87)) U12(NC88) U13(NC89) U14(NC90) V1(NC91) V2(NC92) V3(NC93) V12(NC94) V13(NC95) V14(NC96) W1(NC97) W2(NC98) W3(NC99) W7(NC100) W8(NC101) W9(NC102) W10(NC103) W11(NC104) W12(NC105) W13(NC106) W14(NC107) Y3(NC109) Y6(NC110) Y7(NC111) Y8(NC112) Y9(NC113) Y10(NC114) Y11(NC115) Y12(NC116) Y13(NC117) Y14(NC118)

### Notes on the sheet
- 1、eMMC_DAT[7:0]\CMD\SROTB作为一组并行走线并整组包地，组内等长误差+/-100mil
  2、CLK单独走线并包地，与data延时小于20ps
  3、Tarce impedance  50ohm +/-10%
- (in symbol H3-BGA3XX, part B) NAND
- (in symbol H3-BGA3XX, part I) GND

### Library data of the parts
C50 C51 = 0402 1nF (102) 10% 50V: 贴片电容; ComponentLink1Description: 供应商链接; ComponentLink1URL: http://www.szlcsc.com/product/details_1875.html; Supplier: LC; SuppliersPartNumber: C1523
R33-R36 = 0402 1KΩ (1001) 1%: 贴片电阻; ComponentLink1Description: 供应商链接; ComponentLink1URL: http://www.szlcsc.com/product/details_12256.html; Supplier: LC; SuppliersPartNumber: C11702

## Nets that join several sheets
AVCC_3V3: 4_CPU (10 pins), 5_POWER (C49.2 FB1.2)
GND: 3_DDR3 (41 pins), 4_CPU (110 pins), 5_POWER (34 pins), 6_eMMC (63 pins)
VCC_5V: 4_CPU (6 pins), 5_POWER (16 pins)
VDD1V2_SYS: 4_CPU (18 pins), 5_POWER (6 pins)
VDD_3V3: 4_CPU (20 pins), 5_POWER (7 pins), 6_eMMC (10 pins)
VDD_CPUX: 4_CPU (18 pins), 5_POWER (6 pins)
VDD_DRAN: 3_DDR3 (45 pins), 5_POWER (6 pins)
PWR_DRAM: 4_CPU (U1.M6), 5_POWER (R23.2 U6.8)
PWR_STB: 4_CPU (U1.T2), 5_POWER (R22.2 R28.2 U5.8 U7.8)